# Altium project main_board.PrjPcb
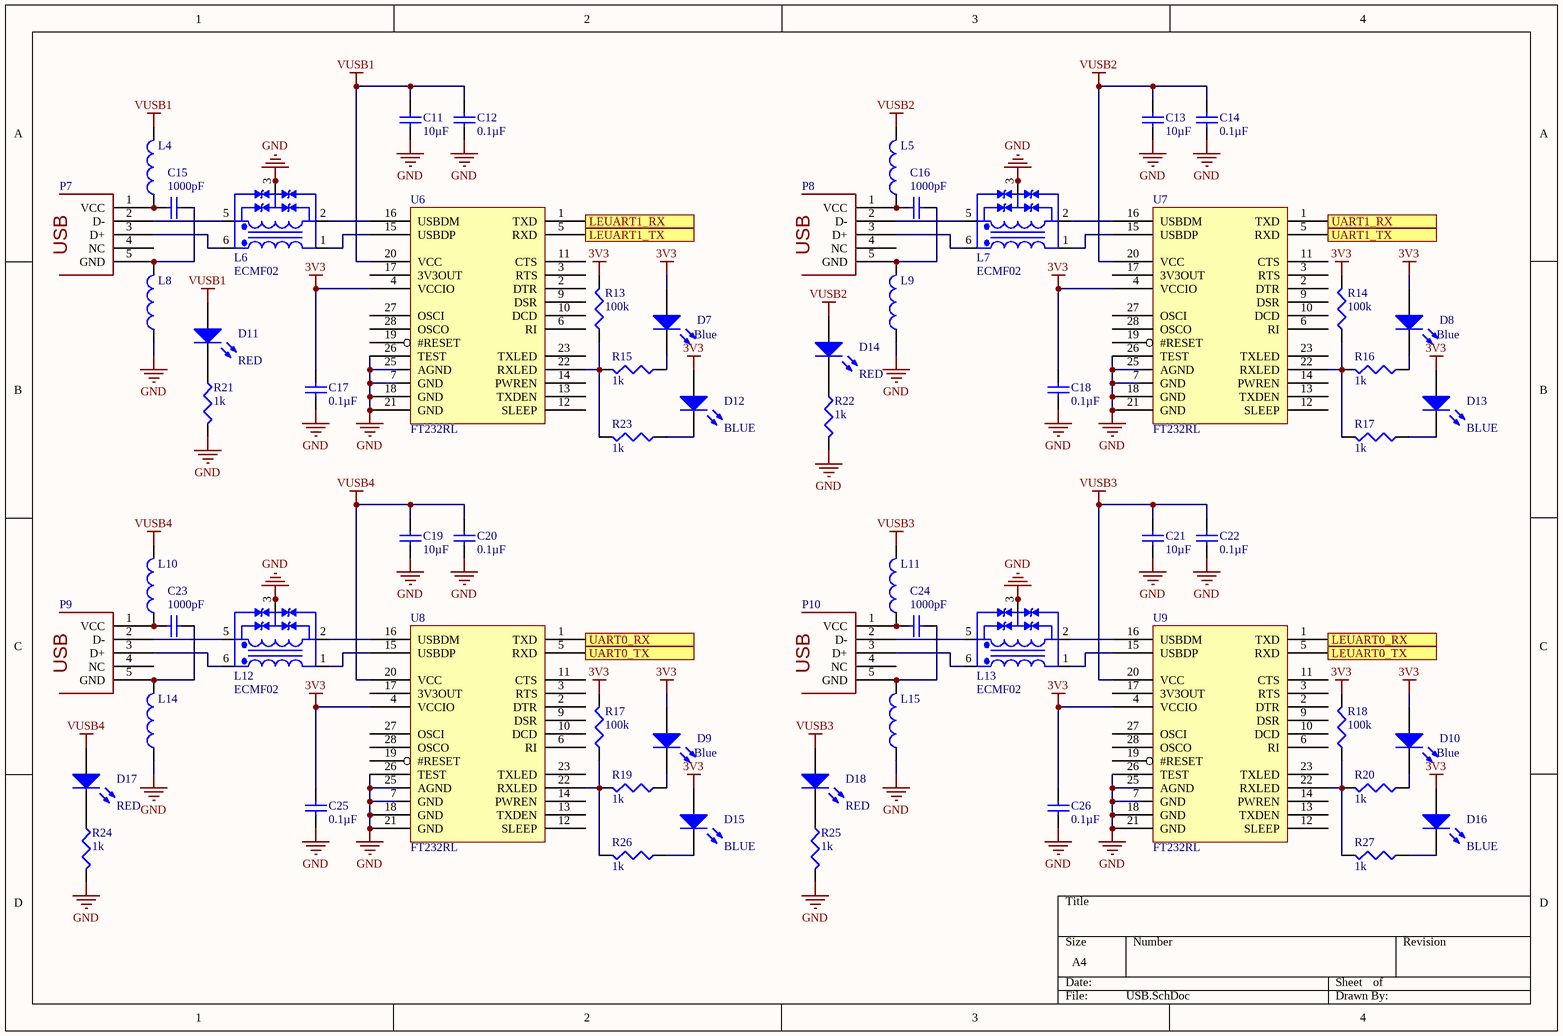
[diagram p0: USB.SchDoc]
3 sheets, 130 parts. Net scope: global (net labels, ports and power ports of the same name join across sheets).
Board file: main_board.PcbDoc
Sheets:
  USB.SchDoc
  STK3701A.SchDoc
  testpoints.SchDoc

## Sheet USB.SchDoc
size A4

### Parts
(Parts that share a designator on the sheet are numbered #1, #2 ... from top to bottom, then left to right.)
C11  value 10µF  [TDK-CGA5L]  (hidden comment: Cap)
C12  value 0.1µF  [TDK-CGA3E]  (hidden comment: Cap)
C13  value 10µF  [TDK-CGA5L]  (hidden comment: Cap)
C14  value 0.1µF  [TDK-CGA3E]  (hidden comment: Cap)
C15  value 1000pF  [TDK-CGA3E]  (hidden comment: Cap)
C16  value 1000pF  [TDK-CGA3E]  (hidden comment: Cap)
C17  value 0.1µF  [TDK-CGA3E]  (hidden comment: Cap)
C18  value 0.1µF  [TDK-CGA3E]  (hidden comment: Cap)
C19  value 10µF  [TDK-CGA5L]  (hidden comment: Cap)
C20  value 0.1µF  [TDK-CGA3E]  (hidden comment: Cap)
C21  value 10µF  [TDK-CGA5L]  (hidden comment: Cap)
C22  value 0.1µF  [TDK-CGA3E]  (hidden comment: Cap)
C23  value 1000pF  [TDK-CGA3E]  (hidden comment: Cap)
C24  value 1000pF  [TDK-CGA3E]  (hidden comment: Cap)
C25  value 0.1µF  [TDK-CGA3E]  (hidden comment: Cap)
C26  value 0.1µF  [TDK-CGA3E]  (hidden comment: Cap)
D7  value Blue  [WL-151034XS03000]  (hidden comment: LED)
D8  value Blue  [WL-151034XS03000]  (hidden comment: LED)
D9  value Blue  [WL-151034XS03000]  (hidden comment: LED)
D10  value Blue  [WL-151034XS03000]  (hidden comment: LED)
D11  value RED  [WL-150060XS75000]  (hidden comment: LED)
D12  value BLUE  [WL-150060XS75000]  (hidden comment: LED)
D13  value BLUE  [WL-150060XS75000]  (hidden comment: LED)
D14  value RED  [WL-150060XS75000]  (hidden comment: LED)
D15  value BLUE  [WL-150060XS75000]  (hidden comment: LED)
D16  value BLUE  [WL-150060XS75000]  (hidden comment: LED)
D17  value RED  [WL-150060XS75000]  (hidden comment: LED)
D18  value RED  [WL-150060XS75000]  (hidden comment: LED)
L4  Inductor  [TDK-MPX1608]  (value not drawn)
L5  Inductor  [TDK-MPX1608]  (value not drawn)
L6  ECMF02  [STM-QFN6L]
L7  ECMF02  [STM-QFN6L]
L8  Inductor  [TDK-MPX1608]  (value not drawn)
L9  Inductor  [TDK-MPX1608]  (value not drawn)
L10  Inductor  [TDK-MPX1608]  (value not drawn)
L11  Inductor  [TDK-MPX1608]  (value not drawn)
L12  ECMF02  [STM-QFN6L]
L13  ECMF02  [STM-QFN6L]
L14  Inductor  [TDK-MPX1608]  (value not drawn)
L15  Inductor  [TDK-MPX1608]  (value not drawn)
P7  USB  [WL-651005136521]  (value not drawn)
P8  USB  [WL-651005136521]  (value not drawn)
P9  USB  [WL-651005136521]  (value not drawn)
P10  USB  [WL-651005136521]  (value not drawn)
R13  value 100k  [PANA-ERJ3EK]  (hidden comment: Res3)
R14  value 100k  [PANA-ERJ3EK]  (hidden comment: Res3)
R15  value 1k  [PANA-ERJ3EK]  (hidden comment: Res3)
R16  value 1k  [PANA-ERJ3EK]  (hidden comment: Res3)
R17#1  value 1k  [PANA-ERJ3EK]  (hidden comment: Res3)
R17#2  value 100k  [PANA-ERJ3EK]  (hidden comment: Res3)
R18  value 100k  [PANA-ERJ3EK]  (hidden comment: Res3)
R19  value 1k  [PANA-ERJ3EK]  (hidden comment: Res3)
R20  value 1k  [PANA-ERJ3EK]  (hidden comment: Res3)
R21  value 1k  [PANA-ERJ3EK]  (hidden comment: Res3)
R22  value 1k  [PANA-ERJ3EK]  (hidden comment: Res3)
R23  value 1k  [PANA-ERJ3EK]  (hidden comment: Res3)
R24  value 1k  [PANA-ERJ3EK]  (hidden comment: Res3)
R25  value 1k  [PANA-ERJ3EK]  (hidden comment: Res3)
R26  value 1k  [PANA-ERJ3EK]  (hidden comment: Res3)
R27  value 1k  [PANA-ERJ3EK]  (hidden comment: Res3)
U6  FT232RL  [FT-SSOP28]
U7  FT232RL  [FT-SSOP28]
U8  FT232RL  [FT-SSOP28]
U9  FT232RL  [FT-SSOP28]

### Ports
LEUART0_RX, LEUART0_TX, LEUART1_RX, LEUART1_TX, UART0_RX, UART0_TX, UART1_RX, UART1_TX

### Nets
3V3: C17.2 C18.2 C25.2 C26.2 D7.1(A) D8.1(A) D9.1(A) D10.1(A) D12.1(A) D13.1(A) D15.1(A) D16.1(A) R13.2 R14.2 R17#2.2 R18.2 U6.4(VCCIO) U7.4(VCCIO) U8.4(VCCIO) U9.4(VCCIO)
GND: C11.1 C12.1 C13.1 C14.1 C17.1 C18.1 C19.1 C20.1 C21.1 C22.1 C25.1 C26.1 L6.3(GND) L6.4(NC) L7.3(GND) L7.4(NC) L8.1 L9.1 L12.3(GND) L12.4(NC) L13.3(GND) L13.4(NC) L14.1 L15.1 R21.2 R22.2 R24.2 R25.2 U6.7(GND) U6.8(NC) U6.18(GND) U6.21(GND) U6.24(NC) U6.25(AGND) U6.26(TEST) U7.7(GND) U7.8(NC) U7.18(GND) U7.21(GND) U7.24(NC) U7.25(AGND) U7.26(TEST) U8.7(GND) U8.8(NC) U8.18(GND) U8.21(GND) U8.24(NC) U8.25(AGND) U8.26(TEST) U9.7(GND) U9.8(NC) U9.18(GND) U9.21(GND) U9.24(NC) U9.25(AGND) U9.26(TEST)
VUSB1: C11.2 C12.2 D11.1(A) L4.2 U6.20(VCC)
VUSB2: C13.2 C14.2 D14.1(A) L5.2 U7.20(VCC)
VUSB3: C21.2 C22.2 D18.1(A) L11.2 U9.20(VCC)
VUSB4: C19.2 C20.2 D17.1(A) L10.2 U8.20(VCC)
NetC15_1: C15.1 L4.1 P7.1(VCC)
NetC15_2: C15.2 L8.2 P7.5(GND)
NetC16_1: C16.1 L5.1 P8.1(VCC)
NetC16_2: C16.2 L9.2 P8.5(GND)
NetC23_1: C23.1 L10.1 P9.1(VCC)
NetC23_2: C23.2 L14.2 P9.5(GND)
NetC24_1: C24.1 L11.1 P10.1(VCC)
NetC24_2: C24.2 L15.2 P10.5(GND)
NetD7_2: D7.2(K) R15.1
NetD8_2: D8.2(K) R16.1
NetD9_2: D9.2(K) R19.1
NetD10_2: D10.2(K) R20.1
NetD11_2: D11.2(K) R21.1
NetD12_2: D12.2(K) R23.1
NetD13_2: D13.2(K) R17#1.1
NetD14_2: D14.2(K) R22.1
NetD15_2: D15.2(K) R26.1
NetD16_2: D16.2(K) R27.1
NetD17_2: D17.2(K) R24.1
NetD18_2: D18.2(K) R25.1
NetL6_1: L6.1(DD+) U6.15(USBDP)
NetL6_2: L6.2(DD-) U6.16(USBDM)
NetL6_5: L6.5(UD-) P7.2(D-)
NetL6_6: L6.6(UD+) P7.3(D+)
NetL7_1: L7.1(DD+) U7.15(USBDP)
NetL7_2: L7.2(DD-) U7.16(USBDM)
NetL7_5: L7.5(UD-) P8.2(D-)
NetL7_6: L7.6(UD+) P8.3(D+)
NetL12_1: L12.1(DD+) U8.15(USBDP)
NetL12_2: L12.2(DD-) U8.16(USBDM)
NetL12_5: L12.5(UD-) P9.2(D-)
NetL12_6: L12.6(UD+) P9.3(D+)
NetL13_1: L13.1(DD+) U9.15(USBDP)
NetL13_2: L13.2(DD-) U9.16(USBDM)
NetL13_5: L13.5(UD-) P10.2(D-)
NetL13_6: L13.6(UD+) P10.3(D+)
NetR13_1: R13.1 R15.2 R23.2 U6.22(RXLED)
NetR14_1: R14.1 R16.2 R17#1.2 U7.22(RXLED)
NetR17#2_1: R17#2.1 R19.2 R26.2 U8.22(RXLED)
NetR18_1: R18.1 R20.2 R27.2 U9.22(RXLED)
NetU6_1: U6.1(TXD) ; port LEUART1_RX
NetU6_5: U6.5(RXD) ; port LEUART1_TX
NetU7_1: U7.1(TXD) ; port UART1_RX
NetU7_5: U7.5(RXD) ; port UART1_TX
NetU8_1: U8.1(TXD) ; port UART0_RX
NetU8_5: U8.5(RXD) ; port UART0_TX
NetU9_1: U9.1(TXD) ; port LEUART0_RX
NetU9_5: U9.5(RXD) ; port LEUART0_TX

Not connected (* = marked no-connect by the designer): P7 4(NC); P8 4(NC); P9 4(NC); P10 4(NC); U6 2(DTR) 3(RTS) 6(RI) 9(DSR) 10(DCD) 11(CTS) 12(SLEEP) 13(TXDEN) 14(PWREN) 17(3V3OUT) 19(#RESET) 23(TXLED) 27(OSCI) 28(OSCO); U7 2(DTR) 3(RTS) 6(RI) 9(DSR) 10(DCD) 11(CTS) 12(SLEEP) 13(TXDEN) 14(PWREN) 17(3V3OUT) 19(#RESET) 23(TXLED) 27(OSCI) 28(OSCO); U8 2(DTR) 3(RTS) 6(RI) 9(DSR) 10(DCD) 11(CTS) 12(SLEEP) 13(TXDEN) 14(PWREN) 17(3V3OUT) 19(#RESET) 23(TXLED) 27(OSCI) 28(OSCO); U9 2(DTR) 3(RTS) 6(RI) 9(DSR) 10(DCD) 11(CTS) 12(SLEEP) 13(TXDEN) 14(PWREN) 17(3V3OUT) 19(#RESET) 23(TXLED) 27(OSCI) 28(OSCO)

### Library data of the parts
C11 C13 C19 C21 = PC-TDK-02917: CAP CER 10UF 25V X7R 1206; Manufacturer Part Number: CGA5L1X7R1E106K160AC; Index: 2917; Tolerance: ±10%; Published: 3/16/2016; LatestRevisionDate: 3/16/2016; LatestRevisionNote: ...; PackageReference: 1206 (3216 Metric); Publisher: AlbertaSat; PackageDescription: Radial Cap, Thru-Hole; 2 Leads; 0.3 in Pin Spacing; Part Number: PC-TDK-02917; Supplier Part Number 1: 445-6990-1-ND; Supplier 1: Digi-key; Supplier Link: http://www.digikey.ca/product-search/en?keywords=445-6990-1-ND; Voltage - Rated: 25V; Temperature Coefficient: X7R; Applications: Automotive
C12 C14 C17 C18 C20 C22 C25 C26 = PC-TDK-02272: CAP CER 0.1UF 50V X8R 0603; Manufacturer Part Number: CGA3E3X8R1H104K080AB; Index: 2272; Tolerance: ±10%; Published: 3/16/2016; LatestRevisionDate: 3/16/2016; LatestRevisionNote: ...; PackageReference: 0603 (1608 Metric); Publisher: AlbertaSat; PackageDescription: Radial Cap, Thru-Hole; 2 Leads; 0.3 in Pin Spacing; Part Number: PC-TDK-02272; Supplier Part Number 1: 445-12606-1-ND; Supplier 1: Digi-key; Supplier Link: http://www.digikey.ca/product-search/en?keywords=445-12606-1-ND; Voltage - Rated: 50V; Temperature Coefficient: X8R; Applications: Automotive
C15 C16 C23 C24 = PC-TDK-01474: CAP CER 1000PF 250V C0G 0603; Manufacturer Part Number: CGA3E3C0G2E102J080AA; Index: 1474; Designator: C?; Tolerance: ±5%; Temperature Coefficient: NP0; Published: 3/16/2016; LatestRevisionDate: 3/16/2016; LatestRevisionNote: ...; PackageReference: 0603 (1608 Metric); Publisher: AlbertaSat; PackageDescription: Radial Cap, Thru-Hole; 2 Leads; 0.3 in Pin Spacing; Part Number: PC-TDK-01474; Supplier Part Number 1: 445-15529-1-ND; Supplier 1: Digi-key; Supplier Link: http://www.digikey.ca/product-search/en?keywords=445-15529-1-ND; Voltage - Rated: 250V; Applications: Automotive
D7-D10 = 51: LED BLUE CLEAR ROUND T/H; Part Number: 51; Manufacturer Part Number: 151034BS03000; Designator: D?; Brightness: 2400mcd; Published: 8-Jun-2000; LatestRevisionDate: 08-Jul-2005; LatestRevisionNote: Mech Layer 1 removed.; PackageReference: Round with Domed Top, 3.00mm; Publisher: Altium Limited; PackageDescription: LED; 2 Leads; Supplier Part Number 1: 732-11401-ND; Supplier 1: Digi-Key; Supplier Part Number 2: 710-151034BS03000; Supplier 2: Mouser; Supplier Link: http://www.digikey.ca/product-search/en?keywords=732-11401-ND
D11 D14 D17 D18 = 3: LED RED CLEAR 0603 SMD; Part Number: 3; Manufacturer Part Number: 150060RS75000; Designator: D?; Brightness: 250mcd; Published: 8-Jun-2000; LatestRevisionDate: 08-Jul-2005; LatestRevisionNote: Mech Layer 1 removed.; PackageReference: WL-150060XS75000; Publisher: Altium Limited; PackageDescription: LED; 2 Leads; Supplier Part Number 1: 732-4978-1-ND; Supplier 1: Digi-Key; Supplier Link: http://www.digikey.ca/product-search/en?keywords=732-4978-1-ND
D12 D13 D15 D16 = 4: LED BLUE CLEAR 0603 SMD; Part Number: 4; Manufacturer Part Number: 150060BS75000; Designator: D?; Brightness: 145mcd; Published: 8-Jun-2000; LatestRevisionDate: 08-Jul-2005; LatestRevisionNote: Mech Layer 1 removed.; PackageReference: WL-150060XS75000; Publisher: Altium Limited; PackageDescription: LED; 2 Leads; Supplier Part Number 1: 732-4966-1-ND; Supplier 1: Digi-Key; Supplier Link: http://www.digikey.ca/product-search/en?keywords=732-4966-1-ND
L4 L5 L8-L11 L14 L15 = PL-TDK-02954: FERRITE BEAD 1 KOHM 0603 1LN; Manufacturer Part Number: MPZ1608S102ATD25; Code_IEC: 1608; Value: 1 kOhm @ 100MHz; Index: 2954; Designator: L?; Current - Rated: 800mA; Published: 7/8/2017; LatestRevisionDate: 7/8/2017; LatestRevisionNote: ...; PackageReference: 0603 (1608 Metric); Publisher: AlbertaSat; PackageDescription: Chip Inductor, 2-Leads, Body 1.60x0.80mm, IPC Low Density; Code_JEITA: 0603; Part Number: PL-TDK-02954; Supplier Part Number 1: 445-172890-1-ND; Supplier 1: Digi-key; Supplier Part Number 2: 810-MPZ1608S102ATD25; Supplier 2: Mouser; Supplier Link: #https://www.digikey.ca/product-detail/en/tdk-corporation/MPZ1608S102ATD25/445-172890-1-ND/5040521#; Applications: Automotive
L6 L7 L12 L13 = PL-STM-00007: CMC 200MA 2LN SMD ESD; Index: 7; Designator: L?; Part Number: PL-STM-00007; Manufacturer Part Number: ECMF02-2AMX6; Supplier Part Number 1: 497-10773-1-ND; Supplier 1: Digi-key; Supplier Part Number 2: 511-ECMF02-2AMX6; Supplier 2: Mouser; Publisher: AlbertaSat; Published: 10/24/2017; LatestRevisionDate: 10/24/2017; LatestRevisionNote: ...; PackageReference: QFN 6-lead; Supplier Link: https://www.digikey.ca/product-detail/en/stmicroelectronics/ECMF02-2AMX6/497-10773-1-ND/2440287
P7-P10 = 1: USB - mini B Receptacle Connector 5 Position Through Hole, Right Angle, Horizontal; Part Number: 1; Manufacturer Part Number: 651005136521; Supplier Part Number 1: 732-2736-5-ND; Supplier 1: Digi-Key; Supplier Link: #http://www.digikey.ca/product-detail/en/651005136521/732-2736-5-ND/2508505#; PackageReference: WL-651005136521
R13 R14 R17#2 R18 = 18744: RES SMD 100K OHM 1% 1/10W 0603; Part Number: 18744; Manufacturer Part Number: ERJ-3EKF1003V; Designator: R?; Power: 0.1W, 1/10W; Temperature Coefficient: ±100ppm/°C; Published: 8-Jun-2000; LatestRevisionDate: 29-May-2009; LatestRevisionNote: IPC-7351 Footprint Added.; PackageReference: 0603 (1608 Metric); Publisher: Altium Limited; PackageDescription: Chip Resistor, 2-Leads, Body 1.60x0.80mm, IPC Low Density; Supplier Part Number 1: P100KHCT-ND; Supplier 1: Digi-Key; Supplier Link: http://www.digikey.ca/product-search/en?keywords=P100KHCT-ND; Tolerance: ±1%
R15 R16 R17#1 R19-R27 = 15398: RES SMD 1K OHM 1% 1/10W 0603; Part Number: 15398; Manufacturer Part Number: ERJ-3EKF1001V; Power: 0.1W, 1/10W; Temperature Coefficient: ±100ppm/°C; Published: 8-Jun-2000; LatestRevisionDate: 29-May-2009; LatestRevisionNote: IPC-7351 Footprint Added.; PackageReference: 0603 (1608 Metric); Publisher: Altium Limited; PackageDescription: Chip Resistor, 2-Leads, Body 1.60x0.80mm, IPC Low Density; Supplier Part Number 1: P1.00KHCT-ND; Supplier 1: Digi-Key; Supplier Link: http://www.digikey.ca/product-search/en?keywords=P1.00KHCT-ND; Tolerance: ±1%
U6-U9 = PU-FT-00001: IC USB FS SERIAL UART 28-SSOP; Manufacturer Part Number: FT232RL-REEL; Index: 1; Part Number: PU-FT-00001; Supplier Part Number 1: 768-1007-1-ND; Supplier 1: Digi-key; Supplier Part Number 2: 895-FT232RL; Supplier 2: Mouser; Publisher: AlbertaSat; Published: 4/5/2017; LatestRevisionDate: 4/5/2017; LatestRevisionNote: ...; PackageReference: FT-SSOP28; Supplier Link: http://www.digikey.ca/product-search/en?keywords=768-1007-1-ND

## Sheet STK3701A.SchDoc
size A4
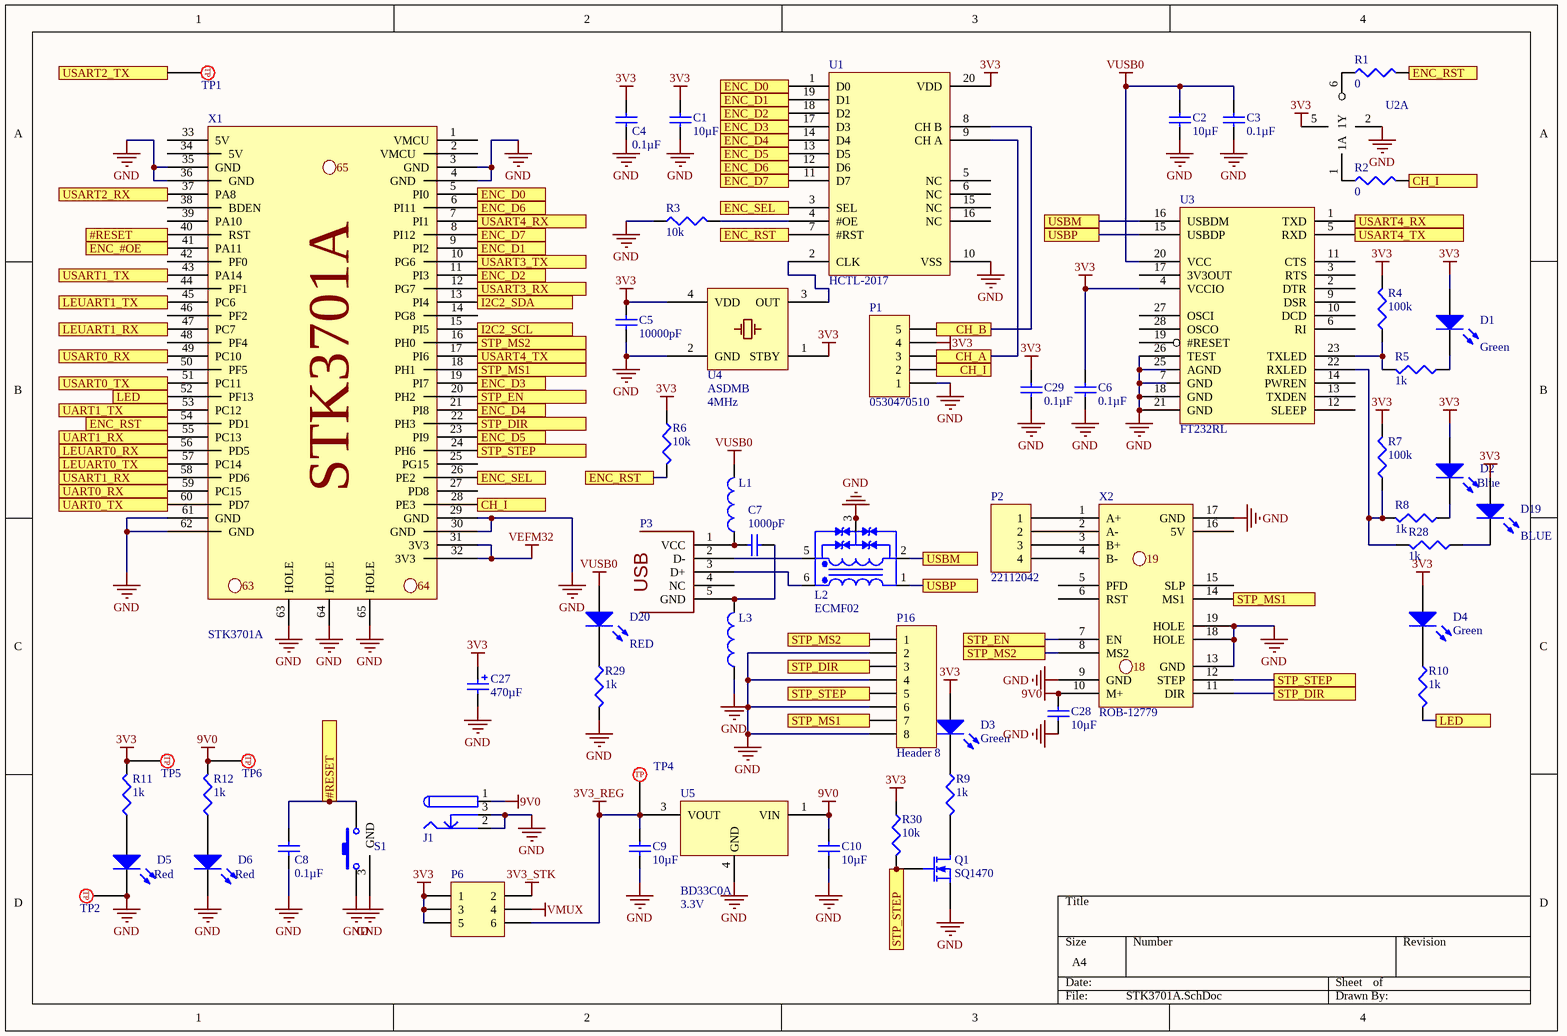
[diagram p1: STK3701A.SchDoc]

### Parts
C1  value 10µF  [TDK-CGA5L]  (hidden comment: Cap)
C2  value 10µF  [TDK-CGA5L]  (hidden comment: Cap)
C3  value 0.1µF  [TDK-CGA3E]  (hidden comment: Cap)
C4  value 0.1µF  [TDK-CGA3E]  (hidden comment: Cap)
C5  value 10000pF  [TDK-CGA3E]  (hidden comment: Cap)
C6  value 0.1µF  [TDK-CGA3E]  (hidden comment: Cap)
C7  value 1000pF  [TDK-CGA3E]  (hidden comment: Cap)
C8  value 0.1µF  [TDK-CGA3E]  (hidden comment: Cap)
C9  value 10µF  [TDK-CGA5L]  (hidden comment: Cap)
C10  value 10µF  [TDK-CGA5L]  (hidden comment: Cap)
C27  value 470µF  [KEM-EDK477M016A9M]  (hidden comment: Cap Pol2)
C28  value 10µF  [TDK-CGA5L]  (hidden comment: Cap)
C29  value 0.1µF  [TDK-CGA3E]  (hidden comment: Cap)
D1  value Green  [WL-151034XS03000]  (hidden comment: LED)
D2  value Blue  [WL-151034XS03000]  (hidden comment: LED)
D3  value Green  [WL-151034XS03000]  (hidden comment: LED)
D4  value Green  [WL-151034XS03000]  (hidden comment: LED)
D5  value Red  [WL-151034XS03000]  (hidden comment: LED)
D6  value Red  [WL-151034XS03000]  (hidden comment: LED)
D19  value BLUE  [WL-150060XS75000]  (hidden comment: LED)
D20  value RED  [WL-150060XS75000]  (hidden comment: LED)
J1  PJ-202BH  [CUI-PJ-202BH]  (value not drawn)
L1  Inductor  [TDK-MPX1608]  (value not drawn)
L2  ECMF02  [STM-QFN6L]
L3  Inductor  [TDK-MPX1608]  (value not drawn)
P1  Manufacturer Part Number: 0530470510  [MOLX-530470510]  (hidden comment: Header 5)
P2  Manufacturer Part Number: 22112042  [MOLX-22112042]  (hidden comment: Header 4)
P3  USB  [WL-651005136521]  (value not drawn)
P6  Header 3x2  [SLN-PRPC003DAA]  (value not drawn)
P16  Header 8  [MOLX-530470810]
Q1  SQ1470  [VSH-SQ1470AEH]
R1  value 0  [PANA-ERJ3G]  (hidden comment: Jumper)
R2  value 0  [PANA-ERJ3G]  (hidden comment: Jumper)
R3  value 10k  [PANA-ERJ3EK]  (hidden comment: Res3)
R4  value 100k  [PANA-ERJ3EK]  (hidden comment: Res3)
R5  value 1k  [PANA-ERJ3EK]  (hidden comment: Res3)
R6  value 10k  [PANA-ERJ3EK]  (hidden comment: Res3)
R7  value 100k  [PANA-ERJ3EK]  (hidden comment: Res3)
R8  value 1k  [PANA-ERJ3EK]  (hidden comment: Res3)
R9  value 1k  [PANA-ERJ3EK]  (hidden comment: Res3)
R10  value 1k  [PANA-ERJ3EK]  (hidden comment: Res3)
R11  value 1k  [PANA-ERJ3EK]  (hidden comment: Res3)
R12  value 1k  [PANA-ERJ3EK]  (hidden comment: Res3)
R28  value 1k  [PANA-ERJ3EK]  (hidden comment: Res3)
R29  value 1k  [PANA-ERJ3EK]  (hidden comment: Res3)
R30  value 10k  [PANA-ERJ3EK]  (hidden comment: Res3)
S1  1825027-6  [TEC-1825027-6]  (value not drawn)
TP1  5017  [KS-5017]  (value not drawn)
TP2  5017  [KS-5017]  (value not drawn)
TP4  5017  [KS-5017]  (value not drawn)
TP5  5017  [KS-5017]  (value not drawn)
TP6  5017  [KS-5017]  (value not drawn)
U1  HCTL-2017  [BCL-PLCC20]
U2  SN74AUP  [TI-TSSOP6]  (value not drawn)  (part A of 2)
U3  FT232RL  [FT-SSOP28]
U4  ASDMB  value 4MHz  [ABR-ASDMB]
U5  BD33C0A  value 3.3V  [TI-TO252]
X1  STK3701A  [STK3701A]
X2  ROB-12779  [ROB-12779]

### Ports
#RESET, CH_A, CH_B, CH_I, ENC_#OE, ENC_D0, ENC_D1, ENC_D2, ENC_D3, ENC_D4, ENC_D5, ENC_D6, ENC_D7, ENC_RST, ENC_SEL, I2C2_SCL, I2C2_SDA, LED, LEUART0_RX, LEUART0_TX, LEUART1_RX, LEUART1_TX, STP_DIR, STP_EN, STP_MS1, STP_MS2, STP_STEP, UART0_RX, UART0_TX, UART1_RX, UART1_TX, USART0_RX, USART0_TX, USART1_RX, USART1_TX, USART2_RX, USART2_TX, USART3_RX, USART3_TX, USART4_RX, USART4_TX, USBM, USBP

### Nets
3V3: C1.2 C4.2 C5.2 C6.2 C27.1 C29.2 D1.1(A) D2.1(A) D3.1(A) D4.1(A) D19.1(A) P1.4 P6.1 P6.3 P6.5 R4.2 R6.1 R7.2 R11.2 R30.2 TP5.1 U1.20(VDD) U2.5(VCC) U3.4(VCCIO) U4.1(STBY) U4.4(VDD)
3V3_REG: C9.2 P6.6 TP4.1 U5.3(VOUT)
3V3_STK: P6.2
9V0: C10.2 C28.2 J1.1 R12.2 TP6.1 U5.1(VIN) X2.10(M+)
GND: C1.1 C2.1 C3.1 C4.1 C5.1 C6.1 C8.1 C9.1 C10.1 C27.2 C28.1 C29.1 D5.2(K) D6.2(K) J1.2 J1.3 L2.3(GND) L2.4(NC) L3.1 P1.1 P16.2 P16.4 P16.6 P16.8 Q1.3(S) R3.2 R29.2 S1.1 S1.3(GND) TP2.1 U1.10(VSS) U2.2(GND) U3.7(GND) U3.8(NC) U3.18(GND) U3.21(GND) U3.24(NC) U3.25(AGND) U3.26(TEST) U4.2(GND) U5.4(GND) X1.3(GND) X1.4(GND) X1.29(GND) X1.30(GND) X1.35(GND) X1.36(GND) X1.61(GND) X1.62(GND) X1.63(HOLE) X1.64(HOLE) X1.65(HOLE) X2.9(GND) X2.13(GND) X2.17(GND) X2.18(HOLE) X2.19(HOLE)
VEFM32: X1.31(3V3) X1.32(3V3)
VMUX: P6.4
VUSB0: C2.2 C3.2 D20.1(A) L1.2 U3.20(VCC)
NetC7_1: C7.1 L1.1 P3.1(VCC)
NetC7_2: C7.2 L3.2 P3.5(GND)
NetC8_2: C8.2 S1.2 X1.40(RST) ; port #RESET
NetD1_2: D1.2(K) R5.1
NetD2_2: D2.2(K) R8.1
NetD3_2: D3.2(K) R9.1
NetD4_2: D4.2(K) R10.1
NetD5_1: D5.1(A) R11.1
NetD6_1: D6.1(A) R12.1
NetD19_2: D19.2(K) R28.1
NetD20_2: D20.2(K) R29.1
NetL2_1: L2.1(DD+) U3.15(USBDP) ; port USBP
NetL2_2: L2.2(DD-) U3.16(USBDM) ; port USBM
NetL2_5: L2.5(UD-) P3.2(D-)
NetL2_6: L2.6(UD+) P3.3(D+)
NetP1_2: P1.2 R2.2 X1.28(PE3) ; port CH_I
NetP1_3: P1.3 U1.9(CH_A) ; port CH_A
NetP1_5: P1.5 U1.8(CH_B) ; port CH_B
NetP2_1: P2.1 X2.1(A+)
NetP2_2: P2.2 X2.2(A-)
NetP2_3: P2.3 X2.3(B+)
NetP2_4: P2.4 X2.4(B-)
NetP4_1: X1.51(PC11) ; port USART0_TX
NetP4_2: X1.49(PC10) ; port USART0_RX
NetP4_5: X1.15(PI5) ; port I2C2_SCL
NetP4_6: X1.13(PI4) ; port I2C2_SDA
NetP5_1: X1.43(PA14) ; port USART1_TX
NetP5_2: X1.58(PD6) ; port USART1_RX
NetP5_3: X1.10(PG6) ; port USART3_TX
NetP5_4: X1.12(PG7) ; port USART3_RX
NetP5_5: TP1.1 ; port USART2_TX
NetP5_6: X1.37(PA8) ; port USART2_RX
NetP11_1: U1.1(D0) X1.5(PI0) ; port ENC_D0
NetP11_3: U1.19(D1) X1.9(PI2) ; port ENC_D1
NetP11_5: U1.18(D2) X1.11(PI3) ; port ENC_D2
NetP11_7: U1.17(D3) X1.19(PI7) ; port ENC_D3
NetP12_1: U1.14(D4) X1.21(PI8) ; port ENC_D4
NetP12_3: U1.13(D5) X1.23(PI9) ; port ENC_D5
NetP12_5: U1.12(D6) X1.6(PI11) ; port ENC_D6
NetP12_7: U1.11(D7) X1.8(PI12) ; port ENC_D7
NetP14_1: U3.1(TXD) X1.7(PI1) ; port USART4_RX
NetP14_3: U3.5(RXD) X1.17(PI6) ; port USART4_TX
NetP15_7: U1.3(SEL) X1.26(PE2) ; port ENC_SEL
NetP16_1: P16.1 X1.16(PH0) X2.8(MS2) ; port STP_MS2
NetP16_3: P16.3 X1.22(PH3) X2.11(DIR) ; port STP_DIR
NetP16_5: P16.5 Q1.2(G) R30.1 X1.24(PH6) X2.12(STEP) ; port STP_STEP
NetP16_7: P16.7 X1.18(PH1) X2.14(MS1) ; port STP_MS1
NetQ1_1: Q1.1(D) R9.2
NetR1_1: R1.1 U2.6(1Y)
NetR1_2: R1.2 R6.2 U1.7(#RST) X1.54(PD1) ; port ENC_RST
NetR2_1: R2.1 U2.1(1A)
NetR3_1: R3.1 U1.4(#OE)
NetR4_1: R4.1 R5.2 U3.23(TXLED)
NetR7_1: R7.1 R8.2 R28.2 U3.22(RXLED)
NetR10_2: R10.2 X1.52(PF13) ; port LED
NetU1_2: U1.2(CLK) U4.3(OUT)
NetU6_1: X1.47(PC7) ; port LEUART1_RX
NetU6_5: X1.45(PC6) ; port LEUART1_TX
NetU7_1: X1.55(PC13) ; port UART1_RX
NetU7_5: X1.53(PC12) ; port UART1_TX
NetU8_1: X1.59(PC15) ; port UART0_RX
NetU8_5: X1.60(PD7) ; port UART0_TX
NetU9_1: X1.56(PD5) ; port LEUART0_RX
NetU9_5: X1.57(PC14) ; port LEUART0_TX
NetX1_20: X1.20(PH2) X2.7(EN) ; port STP_EN
NetX1_41: X1.41(PA11) ; port ENC_#OE

Not connected (* = marked no-connect by the designer): P3 4(NC); U1 5(NC) 6(NC) 15(NC) 16(NC); U3 2(DTR) 3(RTS) 6(RI) 9(DSR) 10(DCD) 11(CTS) 12(SLEEP) 13(TXDEN) 14(PWREN) 17(3V3OUT) 19(#RESET) 27(OSCI) 28(OSCO); X1 1(VMCU) 2(VMCU) 14(PG8) 25(PG15) 27(PD8) 33(5V) 34(5V) 38(BDEN) 39(PA10) 42(PF0) 44(PF1) 46(PF2) 48(PF4) 50(PF5); X2 5(PFD) 6(RST) 15(SLP) 16(5V)

### Notes on the sheet
- (in symbol PTP-KS-00001) TP

### Library data of the parts
C1 C2 C9 C10 C28 = PC-TDK-02917: as C11 on sheet USB; Published: 3/16/2016; LatestRevisionDate: 3/16/2016; LatestRevisionNote: ...; PackageReference: 1206 (3216 Metric); Publisher: AlbertaSat; PackageDescription: Radial Cap, Thru-Hole; 2 Leads; 0.3 in Pin Spacing; Part Number: PC-TDK-02917; Supplier Part Number 1: 445-6990-1-ND; Supplier 1: Digi-key; Supplier Link: http://www.digikey.ca/product-search/en?keywords=445-6990-1-ND; Voltage - Rated: 25V; Temperature Coefficient: X7R; Applications: Automotive
C3 C4 C6 C8 C29 = PC-TDK-02272: as C12 on sheet USB; Published: 3/16/2016; LatestRevisionDate: 3/16/2016; LatestRevisionNote: ...; PackageReference: 0603 (1608 Metric); Publisher: AlbertaSat; PackageDescription: Radial Cap, Thru-Hole; 2 Leads; 0.3 in Pin Spacing; Part Number: PC-TDK-02272; Supplier Part Number 1: 445-12606-1-ND; Supplier 1: Digi-key; Supplier Link: http://www.digikey.ca/product-search/en?keywords=445-12606-1-ND; Voltage - Rated: 50V; Temperature Coefficient: X8R; Applications: Automotive
C5 = PC-TDK-01883: CAP CER 10000PF 100V C0G 0603; Manufacturer Part Number: CGA3E1C0G2A103J080AC; Index: 1883; Designator: C?; Tolerance: ±5%; Temperature Coefficient: NP0; Published: 3/16/2016; LatestRevisionDate: 3/16/2016; LatestRevisionNote: ...; PackageReference: 0603 (1608 Metric); Publisher: AlbertaSat; PackageDescription: Radial Cap, Thru-Hole; 2 Leads; 0.3 in Pin Spacing; Part Number: PC-TDK-01883; Supplier Part Number 1: 445-172688-1-ND; Supplier 1: Digi-key; Supplier Link: http://www.digikey.ca/product-search/en?keywords=445-172688-1-ND; Voltage - Rated: 100V; Applications: Automotive
C7 = PC-TDK-01474: as C15 on sheet USB; Published: 3/16/2016; LatestRevisionDate: 3/16/2016; LatestRevisionNote: ...; PackageReference: 0603 (1608 Metric); Publisher: AlbertaSat; PackageDescription: Radial Cap, Thru-Hole; 2 Leads; 0.3 in Pin Spacing; Part Number: PC-TDK-01474; Supplier Part Number 1: 445-15529-1-ND; Supplier 1: Digi-key; Supplier Link: http://www.digikey.ca/product-search/en?keywords=445-15529-1-ND; Voltage - Rated: 250V; Applications: Automotive
C27 = PC-KEM-02876: CAP ALUM 470UF 20% 16V SMD; Manufacturer Part Number: EDK477M016A9MAA; Index: 2876; Designator: C?; Published: 7/19/2017; LatestRevisionDate: 7/19/2017; LatestRevisionNote: ...; PackageReference: KEM-EDK477M016A9M; Publisher: AlbertaSat; PackageDescription: Aluminum Electrolytic Capacitor, Body 8.30x8.35x10.50mm, IPC Low Density; Part Number: PC-KEM-02876; Supplier Part Number 1: 399-6691-1-ND; Supplier 1: Digi-key; Supplier Part Number 2: 80-EDK477M016A9MAA; Supplier 2: Mouser; Supplier Link: CAP ALUM 470UF 20% 16V SMD#http://CAP ALUM 470UF 20% 16V SMD#; Tolerance: ±20%; Voltage - Rated: 16V; Applications: General Purpose
D1 D3 D4 = 52: LED GREEN CLEAR ROUND T/H; Part Number: 52; Manufacturer Part Number: 151034GS03000; Designator: D?; Brightness: 10000mcd; Published: 8-Jun-2000; LatestRevisionDate: 08-Jul-2005; LatestRevisionNote: Mech Layer 1 removed.; PackageReference: Round with Domed Top, 3.00mm; Publisher: Altium Limited; PackageDescription: LED; 2 Leads; Supplier Part Number 1: 732-11402-ND; Supplier 1: Digi-Key; Supplier Part Number 2: 710-151034GS03000; Supplier 2: Mouser; Supplier Link: http://www.digikey.ca/product-search/en?keywords=732-11402-ND
D2 = 51: as D7 on sheet USB; Published: 8-Jun-2000; LatestRevisionDate: 08-Jul-2005; LatestRevisionNote: Mech Layer 1 removed.; PackageReference: Round with Domed Top, 3.00mm; Publisher: Altium Limited; PackageDescription: LED; 2 Leads; Supplier Part Number 1: 732-11401-ND; Supplier 1: Digi-Key; Supplier Part Number 2: 710-151034BS03000; Supplier 2: Mouser; Supplier Link: http://www.digikey.ca/product-search/en?keywords=732-11401-ND
D5 D6 = 50: LED RED CLEAR ROUND T/H; Part Number: 50; Manufacturer Part Number: 151034RS03000; Designator: D?; Brightness: 2600mcd; Published: 8-Jun-2000; LatestRevisionDate: 08-Jul-2005; LatestRevisionNote: Mech Layer 1 removed.; PackageReference: Round with Domed Top, 3.00mm; Publisher: Altium Limited; PackageDescription: LED; 2 Leads; Supplier Part Number 1: 732-11403-ND; Supplier 1: Digi-Key; Supplier Part Number 2: 710-151034RS03000; Supplier 2: Mouser; Supplier Link: http://www.digikey.ca/product-search/en?keywords=732-11403-ND
D19 = 4: as D12 on sheet USB; Published: 8-Jun-2000; LatestRevisionDate: 08-Jul-2005; LatestRevisionNote: Mech Layer 1 removed.; PackageReference: WL-150060XS75000; Publisher: Altium Limited; PackageDescription: LED; 2 Leads; Supplier Part Number 1: 732-4966-1-ND; Supplier 1: Digi-Key; Supplier Link: http://www.digikey.ca/product-search/en?keywords=732-4966-1-ND
D20 = 3: as D11 on sheet USB; Published: 8-Jun-2000; LatestRevisionDate: 08-Jul-2005; LatestRevisionNote: Mech Layer 1 removed.; PackageReference: WL-150060XS75000; Publisher: Altium Limited; PackageDescription: LED; 2 Leads; Supplier Part Number 1: 732-4978-1-ND; Supplier 1: Digi-Key; Supplier Link: http://www.digikey.ca/product-search/en?keywords=732-4978-1-ND
J1 = PP-CUI-00001: CONN PWR JACK 2.5X5.5MM SOLDER; Index: 1; Designator: P?; Voltage - Rated: 24VDC; Part Number: PP-CUI-00001; Manufacturer Part Number: PJ-202BH; Supplier Part Number 1: CP-202BH-ND; Supplier 1: Digi-key; Supplier Part Number 2: 490-PJ-202BH; Supplier 2: Mouser; Publisher: AlbertaSat; Published: 2018-05-07; LatestRevisionDate: 2018-05-07; LatestRevisionNote: ...; PackageReference: PWR JACK 2.5X5.5MM; PackageDescription: PWR JACK 2.5X5.5MM; Supplier Link: #https://www.digikey.ca/product-detail/en/cui-inc/PJ-202BH/CP-202BH-ND/408451#
L1 L3 = PL-TDK-02954: as L4 on sheet USB; Published: 7/8/2017; LatestRevisionDate: 7/8/2017; LatestRevisionNote: ...; PackageReference: 0603 (1608 Metric); Publisher: AlbertaSat; PackageDescription: Chip Inductor, 2-Leads, Body 1.60x0.80mm, IPC Low Density; Code_JEITA: 0603; Part Number: PL-TDK-02954; Supplier Part Number 1: 445-172890-1-ND; Supplier 1: Digi-key; Supplier Part Number 2: 810-MPZ1608S102ATD25; Supplier 2: Mouser; Supplier Link: #https://www.digikey.ca/product-detail/en/tdk-corporation/MPZ1608S102ATD25/445-172890-1-ND/5040521#; Applications: Automotive
L2 = PL-STM-00007: as L6 on sheet USB; Part Number: PL-STM-00007; Manufacturer Part Number: ECMF02-2AMX6; Supplier Part Number 1: 497-10773-1-ND; Supplier 1: Digi-key; Supplier Part Number 2: 511-ECMF02-2AMX6; Supplier 2: Mouser; Publisher: AlbertaSat; Published: 10/24/2017; LatestRevisionDate: 10/24/2017; LatestRevisionNote: ...; PackageReference: QFN 6-lead; Supplier Link: https://www.digikey.ca/product-detail/en/stmicroelectronics/ECMF02-2AMX6/497-10773-1-ND/2440287
P1 = 42: CONN HEADER 5POS 1.25MM VERT TIN; Part Number: 42; Designator: P?; LatestRevisionDate: 17-Jul-2002; LatestRevisionNote: Re-released for DXP Platform.; Publisher: Altium Limited; Supplier Part Number 1: WM1734-ND; Supplier 1: Digi-Key; Supplier Link: #https://www.digikey.ca/products/en?keywords=530470510#; PackageReference: MOLX-530470510
P2 = 34: CONN HEADER 4POS .100 VERT GOLD; Part Number: 34; Designator: P?; LatestRevisionDate: 17-Jul-2002; LatestRevisionNote: Re-released for DXP Platform.; Publisher: Altium Limited; Supplier Part Number 1: WM2702-ND; Supplier 1: Digi-Key; Supplier Link: http://www.digikey.ca/product-search/en?keywords=WM2702-ND; PackageReference: MOLX-22112042
P3 = 1: as P7 on sheet USB; Supplier Part Number 1: 732-2736-5-ND; Supplier 1: Digi-Key; Supplier Link: #http://www.digikey.ca/product-detail/en/651005136521/732-2736-5-ND/2508505#; PackageReference: WL-651005136521
P6 = PP-SLN-00064: CONN HEADER .100"" DUAL STR 6POS; Manufacturer Part Number: PRPC003DAAN-RC; Index: 64; Designator: P?; Number of Positions: 6; Pitch: 0.100" (2.54mm); Post Length: 0.120" (3.05mm); Mating Length: 0.230" (5.84mm); LatestRevisionDate: 2017-03-17; LatestRevisionNote: ...; Publisher: AlbertaSat; Part Number: PP-SLN-00064; Supplier Part Number 1: S2011EC-03-ND; Supplier 1: Digi-key; Published: 2017-03-17; PackageReference: SLN-PRPC003DAA; PackageDescription: CONN HEADER .100"" DUAL STR 6POS; Supplier Link: http://www.digikey.ca/product-search/en?keywords=S2011EC-03-ND; Number of Rows: 2; Mounting Type: Through Hole
P16 = 12: CONN HEADER 8POS 1.25MM VERT TIN; Part Number: 12; Manufacturer Part Number: 530470810; Designator: P?; LatestRevisionDate: 17-Jul-2002; LatestRevisionNote: Re-released for DXP Platform.; Publisher: Altium Limited; Supplier Part Number 1: WM1737-ND; Supplier 1: Digi-Key; Supplier Link: http://www.digikey.ca/product-search/en?keywords=WM1737-ND; PackageReference: MOLX-530470810
Q1 = PQ-VSH-00227: MOSFET N-CH 30V 2.8A SC70; Manufacturer Part Number: SQ1470AEH-T1_GE3; Index: 227; Designator: Q?; Published: 7/12/2017; LatestRevisionDate: 7/12/2017; LatestRevisionNote: ...; PackageVersion: 1995/1996; PackageReference: VSH-SOT363; Publisher: AlbertaSat; PackageDescription: SOT23, 6-Leads, Body 2.00x2.10mm, Pitch 0.65mm, IPC Low Density; Part Number: PQ-VSH-00227; Supplier Part Number 1: SQ1470AEH-T1_GE3CT-ND; Supplier 1: Digi-key; Supplier Part Number 2: 78-SQ1470AEH-T1_GE3; Supplier 2: Mouser; Supplier Link: #https://www.digikey.ca/product-detail/en/vishay-siliconix/SQ1470AEH-T1_GE3/SQ1470AEH-T1_GE3CT-ND/6595360#; Applications: Automotive
R1 R2 = 13128: RES SMD 0.0OHM JUMPER 1/10W 0603; Part Number: 13128; Manufacturer Part Number: ERJ-3GEY0R00V; Designator: R?; Power: 0.1W, 1/10W; PackageDescription: Chip Resistor, 2-Leads, Body 1.60x0.80mm, IPC Low Density; Supplier Part Number 1: P0.0GCT-ND; Supplier 1: Digi-Key; Supplier Link: http://www.digikey.ca/product-search/en?keywords=P0.0GCT-ND; PackageReference: 0603 (1608 Metric); Tolerance: Jumper; Temperature Coefficient: -; Type: Jumper
R3 R6 R30 = 17203: RES SMD 10K OHM 1% 1/10W 0603; Part Number: 17203; Manufacturer Part Number: ERJ-3EKF1002V; Designator: R?; Power: 0.1W, 1/10W; Temperature Coefficient: ±100ppm/°C; Published: 8-Jun-2000; LatestRevisionDate: 29-May-2009; LatestRevisionNote: IPC-7351 Footprint Added.; PackageReference: 0603 (1608 Metric); Publisher: Altium Limited; PackageDescription: Chip Resistor, 2-Leads, Body 1.60x0.80mm, IPC Low Density; Supplier Part Number 1: P10.0KHCT-ND; Supplier 1: Digi-Key; Supplier Link: http://www.digikey.ca/product-search/en?keywords=P10.0KHCT-ND; Tolerance: ±1%
R4 R7 = 18744: as R13 on sheet USB; Published: 8-Jun-2000; LatestRevisionDate: 29-May-2009; LatestRevisionNote: IPC-7351 Footprint Added.; PackageReference: 0603 (1608 Metric); Publisher: Altium Limited; PackageDescription: Chip Resistor, 2-Leads, Body 1.60x0.80mm, IPC Low Density; Supplier Part Number 1: P100KHCT-ND; Supplier 1: Digi-Key; Supplier Link: http://www.digikey.ca/product-search/en?keywords=P100KHCT-ND; Tolerance: ±1%
R5 R8-R10 R28 R29 = 15398: as R15 on sheet USB; Published: 8-Jun-2000; LatestRevisionDate: 29-May-2009; LatestRevisionNote: IPC-7351 Footprint Added.; PackageReference: 0603 (1608 Metric); Publisher: Altium Limited; PackageDescription: Chip Resistor, 2-Leads, Body 1.60x0.80mm, IPC Low Density; Supplier Part Number 1: P1.00KHCT-ND; Supplier 1: Digi-Key; Supplier Link: http://www.digikey.ca/product-search/en?keywords=P1.00KHCT-ND; Tolerance: ±1%
R11 R12 = 15398: RES SMD 1K OHM 1% 1/10W 0603; Part Number: 15398; Manufacturer Part Number: ERJ-3EKF1001V; Designator: R?; Power: 0.1W, 1/10W; Temperature Coefficient: ±100ppm/°C; Published: 8-Jun-2000; LatestRevisionDate: 29-May-2009; LatestRevisionNote: IPC-7351 Footprint Added.; PackageReference: 0603 (1608 Metric); Publisher: Altium Limited; PackageDescription: Chip Resistor, 2-Leads, Body 1.60x0.80mm, IPC Low Density; Supplier Part Number 1: P1.00KHCT-ND; Supplier 1: Digi-Key; Supplier Link: http://www.digikey.ca/product-search/en?keywords=P1.00KHCT-ND; Tolerance: ±1%
S1 = 450: SWITCH TACTILE SPST-NO 0.05A 24V; Part Number: 450; Designator: S?; Power (Watts): 1.2W; Manufacturer Part Number: 1825027-6; Supplier Part Number 1: A109320-ND; Supplier 1: Digi-Key; Supplier Link: http://www.digikey.ca/product-search/en?keywords=A109320-ND; PackageReference: 1825027-6; PackageDescription: Tactile Switch SPST-NO Side Actuated Through Hole, Right Angle
TP1 TP2 TP4-TP6 = PTP-KS-00001: PC TEST POINT MINI SMD; Index: 1; Designator: TP?; Part Number: PTP-KS-00001; Manufacturer Part Number: 5017; Supplier Part Number 1: 36-5017CT-ND; Supplier 1: Digi-key; Publisher: AlbertaSat; Published: 2016-03-15; LatestRevisionDate: 2016-03-15; LatestRevisionNote: ...; PackageReference: KS-5017; PackageDescription: Testpoint Lug Mini SMD 27X10X152; Supplier Link: #http://www.digikey.ca/product-detail/en/keystone-electronics/5017/36-5017TR-ND/2217304#
U1 = PU-BCL-00001: IC DECODER/COUNTER 16BIT 20-PLCC; Index: 1; Designator: U?; Part Number: PU-BCL-00001; Manufacturer Part Number: HCTL-2017-PLC; Supplier Part Number 1: 516-1882-5-ND; Supplier 1: Digi-key; Supplier Part Number 2: 630-HCTL-2017-PLC; Supplier 2: Mouser; Publisher: AlbertaSat; Published: 2018-05-07; LatestRevisionDate: 2018-05-07; LatestRevisionNote: ...; PackageReference: 20-LCC (J-Lead); PackageDescription: Leaded Chip Carrier, 20-Leads, Body 9.91x9.91mm, Pitch 1.270mm, IPC Low Density; Supplier Link: #https://www.digikey.ca/product-detail/en/broadcom-limited/HCTL-2017-PLC/516-1882-5-ND/1236053#
U2 = 31: IC INVERTER BUFF/DVR DL SC70-6; Part Number: 31; Manufacturer Part Number: SN74AUP2G06DCKR; Designator: U?; Supplier Part Number 1: 296-27354-1-ND; Supplier 1: Digi-Key; Supplier Link: #https://www.digikey.ca/product-detail/en/texas-instruments/SN74AUP2G06DCKR/296-27354-1-ND/2279315#; PackageReference: TI-TSSOP6
U3 = PU-FT-00001: as U6 on sheet USB; Part Number: PU-FT-00001; Supplier Part Number 1: 768-1007-1-ND; Supplier 1: Digi-key; Supplier Part Number 2: 895-FT232RL; Supplier 2: Mouser; Publisher: AlbertaSat; Published: 4/5/2017; LatestRevisionDate: 4/5/2017; LatestRevisionNote: ...; PackageReference: FT-SSOP28; Supplier Link: http://www.digikey.ca/product-search/en?keywords=768-1007-1-ND
U4 = PU-ABR-00008: OSC MEMS 4.000MHZ CMOS SMD; Manufacturer Part Number: ASDMB-4.000MHZ-XY-T; Index: 8; Designator: U?; Tolerance: ±10ppm; Part Number: PU-ABR-00008; Supplier Part Number 1: 535-11165-1-ND; Supplier 1: Digi-key; Supplier Part Number 2: 815-ASDMB-4-XY-T; Supplier 2: Mouser; Publisher: AlbertaSat; Published: 2017-10-24; LatestRevisionDate: 2017-10-24; LatestRevisionNote: ...; PackageReference: 4-SMD, No Lead; PackageDescription: DFN, 4-Leads, Body 2.00x2.50mm, Pitch 1.65mm, IPC Low Density; Supplier Link: http://www.digikey.ca/product-search/en?keywords=535-11165-1-ND
U5 = 17: IC REG LDO 3.3V 0.3A TO-252-3; Part Number: 17; Designator: U?; Manufacturer Part Number: TPS7A6533QKVURQ1; Supplier Part Number 1: BD33C0AFP-CE2CT-ND; Supplier 1: Digi-Key; Supplier Link: #https://www.digikey.com/product-detail/en/texas-instruments/TPS7A6533QKVURQ1/296-36857-1-ND/4341406#; PackageReference: TI-TO252

## Sheet testpoints.SchDoc
size A4
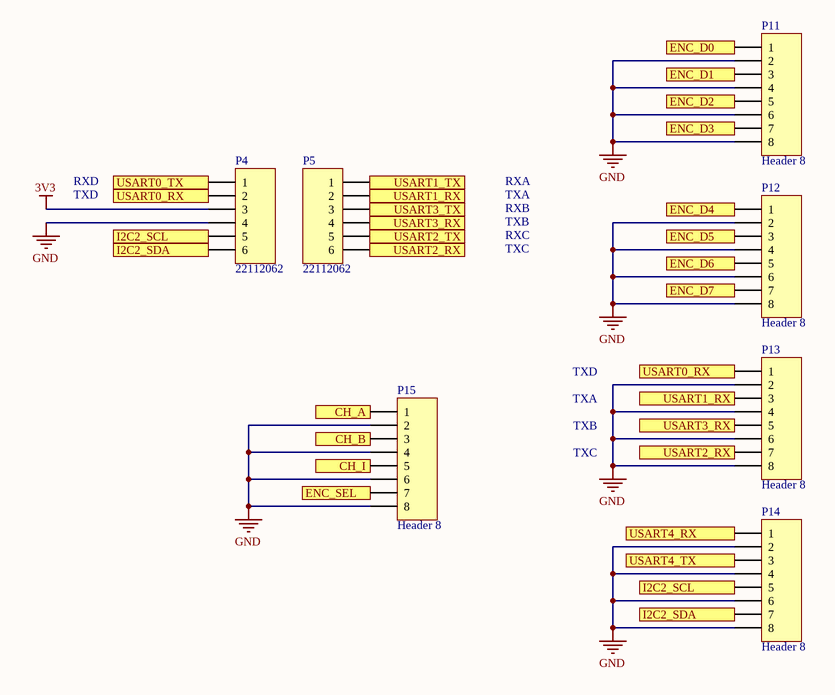
[diagram p2: testpoints.SchDoc]

### Parts
P4  Manufacturer Part Number: 22112062  [MOLX-22112062]  (hidden comment: Header 6)
P5  Manufacturer Part Number: 22112062  [MOLX-22112062]  (hidden comment: Header 6)
P11  Header 8  [MOLX-530470810]
P12  Header 8  [MOLX-530470810]
P13  Header 8  [MOLX-530470810]
P14  Header 8  [MOLX-530470810]
P15  Header 8  [MOLX-530470810]

### Ports
CH_A, CH_B, CH_I, ENC_D0, ENC_D1, ENC_D2, ENC_D3, ENC_D4, ENC_D5, ENC_D6, ENC_D7, ENC_SEL, I2C2_SCL, I2C2_SDA, USART0_RX, USART0_TX, USART1_RX, USART1_TX, USART2_RX, USART2_TX, USART3_RX, USART3_TX, USART4_RX, USART4_TX

### Nets
3V3: P4.3
GND: P4.4 P11.2 P11.4 P11.6 P11.8 P12.2 P12.4 P12.6 P12.8 P13.2 P13.4 P13.6 P13.8 P14.2 P14.4 P14.6 P14.8 P15.2 P15.4 P15.6 P15.8
NetP1_2: P15.5 ; port CH_I
NetP1_3: P15.1 ; port CH_A
NetP1_5: P15.3 ; port CH_B
NetP4_1: P4.1 ; port USART0_TX
NetP4_2: P4.2 P13.1 ; port USART0_RX
NetP4_5: P4.5 P14.5 ; port I2C2_SCL
NetP4_6: P4.6 P14.7 ; port I2C2_SDA
NetP5_1: P5.1 ; port USART1_TX
NetP5_2: P5.2 P13.3 ; port USART1_RX
NetP5_3: P5.3 ; port USART3_TX
NetP5_4: P5.4 P13.5 ; port USART3_RX
NetP5_5: P5.5 ; port USART2_TX
NetP5_6: P5.6 P13.7 ; port USART2_RX
NetP11_1: P11.1 ; port ENC_D0
NetP11_3: P11.3 ; port ENC_D1
NetP11_5: P11.5 ; port ENC_D2
NetP11_7: P11.7 ; port ENC_D3
NetP12_1: P12.1 ; port ENC_D4
NetP12_3: P12.3 ; port ENC_D5
NetP12_5: P12.5 ; port ENC_D6
NetP12_7: P12.7 ; port ENC_D7
NetP14_1: P14.1 ; port USART4_RX
NetP14_3: P14.3 ; port USART4_TX
NetP15_7: P15.7 ; port ENC_SEL

### Notes on the sheet
- RXD
- TXD
- RXA
- TXA
- RXB
- TXB
- RXC
- TXC

### Library data of the parts
P4 P5 = 36: CONN HEADER 6POS .100 VERT GOLD; Part Number: 36; Designator: P?; LatestRevisionDate: 17-Jul-2002; LatestRevisionNote: Re-released for DXP Platform.; Publisher: Altium Limited; Supplier Part Number 1: WM2704-ND; Supplier 1: Digi-Key; Supplier Link: http://www.digikey.ca/product-search/en?keywords=WM2704-ND; PackageReference: MOLX-22112062
P11-P15 = 12: as P16 on sheet STK3701A; LatestRevisionDate: 17-Jul-2002; LatestRevisionNote: Re-released for DXP Platform.; Publisher: Altium Limited; Supplier Part Number 1: WM1737-ND; Supplier 1: Digi-Key; Supplier Link: http://www.digikey.ca/product-search/en?keywords=WM1737-ND; PackageReference: MOLX-530470810

## Nets that join several sheets
3V3: USB (20 pins), STK3701A (26 pins), testpoints (P4.3)
GND: USB (56 pins), STK3701A (57 pins), testpoints (21 pins)
NetP1_2: STK3701A (P1.2 R2.2 X1.28), testpoints (P15.5)
NetP1_3: STK3701A (P1.3 U1.9), testpoints (P15.1)
NetP1_5: STK3701A (P1.5 U1.8), testpoints (P15.3)
NetP4_1: STK3701A (X1.51), testpoints (P4.1)
NetP4_2: STK3701A (X1.49), testpoints (P4.2 P13.1)
NetP4_5: STK3701A (X1.15), testpoints (P4.5 P14.5)
NetP4_6: STK3701A (X1.13), testpoints (P4.6 P14.7)
NetP5_1: STK3701A (X1.43), testpoints (P5.1)
NetP5_2: STK3701A (X1.58), testpoints (P5.2 P13.3)
NetP5_3: STK3701A (X1.10), testpoints (P5.3)
NetP5_4: STK3701A (X1.12), testpoints (P5.4 P13.5)
NetP5_5: STK3701A (TP1.1), testpoints (P5.5)
NetP5_6: STK3701A (X1.37), testpoints (P5.6 P13.7)
NetP11_1: STK3701A (U1.1 X1.5), testpoints (P11.1)
NetP11_3: STK3701A (U1.19 X1.9), testpoints (P11.3)
NetP11_5: STK3701A (U1.18 X1.11), testpoints (P11.5)
NetP11_7: STK3701A (U1.17 X1.19), testpoints (P11.7)
NetP12_1: STK3701A (U1.14 X1.21), testpoints (P12.1)
NetP12_3: STK3701A (U1.13 X1.23), testpoints (P12.3)
NetP12_5: STK3701A (U1.12 X1.6), testpoints (P12.5)
NetP12_7: STK3701A (U1.11 X1.8), testpoints (P12.7)
NetP14_1: STK3701A (U3.1 X1.7), testpoints (P14.1)
NetP14_3: STK3701A (U3.5 X1.17), testpoints (P14.3)
NetP15_7: STK3701A (U1.3 X1.26), testpoints (P15.7)
NetU6_1: USB (U6.1), STK3701A (X1.47)
NetU6_5: USB (U6.5), STK3701A (X1.45)
NetU7_1: USB (U7.1), STK3701A (X1.55)
NetU7_5: USB (U7.5), STK3701A (X1.53)
NetU8_1: USB (U8.1), STK3701A (X1.59)
NetU8_5: USB (U8.5), STK3701A (X1.60)
NetU9_1: USB (U9.1), STK3701A (X1.56)
NetU9_5: USB (U9.5), STK3701A (X1.57)